# Altium schematic sheet pca10171_io_expander.SchDoc: =BoardTitle + ' - IO Expander'
size A3; Organization: Nordic Semiconductor; DocumentNumber: 5; SheetNumber: 5; SheetTotal: 10; CompanyName: Nordic Semiconductor; DocumentSize: A3
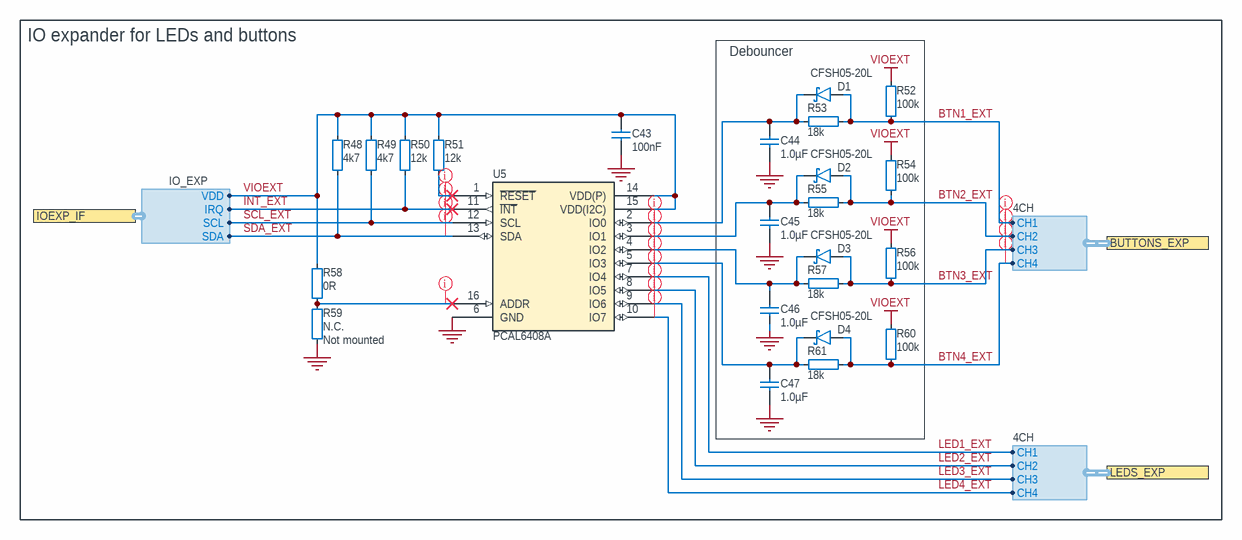
[diagram p0: pca10171_io_expander.SchDoc]

## Parts
C43  100nF  [CAPC0603X03L_C]
C44  1.0µF  [CAPC0603X03L_C]
C45  1.0µF  [CAPC0603X03L_C]
C46  1.0µF  [CAPC0603X03L_C]
C47  1.0µF  [CAPC0603X03L_C]
D1  CFSH05-20L  [SODFL35X40-2N]
D2  CFSH05-20L  [SODFL35X40-2N]
D3  CFSH05-20L  [SODFL35X40-2N]
D4  CFSH05-20L  [SODFL35X40-2N]
R48  4k7  [RESC0603X03L_C]
R49  4k7  [RESC0603X03L_C]
R50  12k  [RESC0603X03L_C]
R51  12k  [RESC0603X03L_C]
R52  100k  [RESC0603X03L_C]
R53  18k  [RESC0603X03L_C]
R54  100k  [RESC0603X03L_C]
R55  18k  [RESC0603X03L_C]
R56  100k  [RESC0603X03L_C]
R57  18k  [RESC0603X03L_C]
R58  0R  [RESC0603X03L_C]
R59  N.C.  Assembly: Not mounted  [RESC0603X03L_C_NC]
R60  100k  [RESC0603X03L_C]
R61  18k  [RESC0603X03L_C]
U5  PCAL6408A  [XQFN40P180X260X50-16N]

## Blocks framed on the sheet
IO expander for LEDs and buttons: C43 R48-R51 R58 R59 U5
Debouncer: C44-C47 D1-D4 R52-R57 R60 R61

## Ports
BUTTONS_EXP (harness 4CH), IOEXP_IF (harness IO_EXP), LEDS_EXP (harness 4CH)

## Harnesses
IO_EXP: VDD, SCL, SDA, IRQ
4CH: CH1, CH2, CH3, CH4

## Nets
GND: C43.1 C44.2 C45.1 C46.1 C47.1 R59.1 U5.6(GND)
VIOEXT: C43.2 R48.2 R49.2 R50.2 R51.2 R52.2 R54.2 R56.2 R58.2 R60.2 U5.14(VDD(P)) U5.15(VDD(I2C)) ; port IOEXP_IF.VDD
BTN1_EXT: D1.1(A) R52.1 R53.2 ; port BUTTONS_EXP.CH1
BTN2_EXT: D2.1(A) R54.1 R55.2 ; port BUTTONS_EXP.CH2
BTN3_EXT: D3.1(A) R56.1 R57.2 ; port BUTTONS_EXP.CH3
BTN4_EXT: D4.1(A) R60.1 R61.2 ; port BUTTONS_EXP.CH4
INT_EXT: R50.1 U5.11(~{INT}) ; port IOEXP_IF.IRQ
LED1_EXT: U5.7(IO4) ; port LEDS_EXP.CH1
LED2_EXT: U5.8(IO5) ; port LEDS_EXP.CH2
LED3_EXT: U5.9(IO6) ; port LEDS_EXP.CH3
LED4_EXT: U5.10(IO7) ; port LEDS_EXP.CH4
SCL_EXT: R49.1 U5.12(SCL) ; port IOEXP_IF.SCL
SDA_EXT: R48.1 U5.13(SDA) ; port IOEXP_IF.SDA
NetC44_1: C44.1 D1.3(C) R53.1 U5.2(IO0)
NetC45_2: C45.2 D2.3(C) R55.1 U5.3(IO1)
NetC46_2: C46.2 D3.3(C) R57.1 U5.4(IO2)
NetC47_2: C47.2 D4.3(C) R61.1 U5.5(IO3)
NetR51_1: R51.1 U5.1(~{RESET})
NetR58_1: R58.1 R59.2 U5.16(ADDR)

## Layout directives
net class GPIO: BTN1_EXT, BTN2_EXT, BTN3_EXT, BTN4_EXT, INT_EXT, LED1_EXT, LED2_EXT, LED3_EXT, LED4_EXT, NetC44_1, NetC45_2, NetC46_2, NetC47_2, NetR51_1, NetR58_1, SCL_EXT, SDA_EXT

## Notes on the sheet
- Title
- Size
- Date:
- File:
- A3
- PCB Assembly Number
- Sheet         of
- Drawn By:
- Revision
- Classification:

## Library data of the parts
C43 = C0201-100n: Capacitor, X5R, ±10%; Manufacturer: N.A.; Part number IPS: 00000001248, 00000002505; Part number Norautron: 262071862; Part number NEMS: 100200078; Note: 16V; Pad Count: 2; Component Status: Active; Part Number: C0201-100n; Manufacturer Part Number: N.A.; Footprint Doc: 0201; LatestRevisionDate: 2017-11-09; Published: 2014-11-13; Value: 100nF; Artikkelnr Noca: N.A.; ComponentLink1URL: N.A.; ComponentLink1Description: Datasheet; ComponentLink2URL: N.A.; ComponentLink2Description: Supplier link; HelpURL: N.A.; Supplier 1: N.A.; Supplier Part Number 1: N.A.; Supplier 2: N.A.; Supplier Part Number 2: N.A.; PartId: 100200078; Component Class: Capacitors; Author: rsk
C44-C47 = C0201-1µ0: Capacitor, X5R, ±10%; Manufacturer: N.A.; Part number IPS: 00000001723; Part number NEMS: 100200084; Note: 10V; Pad Count: 2; Component Status: Active; Part Number: C0201-1µ0; Manufacturer Part Number: N.A.; Footprint Doc: 0201; LatestRevisionDate: 2016-08-22; Published: 2009-05-08; Value: 1.0µF; Artikkelnr Noca: N.A.; ComponentLink1URL: N.A.; ComponentLink1Description: Datasheet; ComponentLink2URL: N.A.; ComponentLink2Description: Supplier link; HelpURL: N.A.; Supplier 1: Digi-Key; Supplier Part Number 1: 1276-6795-1-ND; Supplier 2: N.A.; Supplier Part Number 2: N.A.; PartId: 100200084; Component Class: Capacitors; Author: rsk; Part number Norautron: N.A.
D1-D4 = CFSH05-20L: DIODE SCHOTTKY 20V 500MA SOD882; Manufacturer: Central Semiconductor Corp.; Part number IPS: 00000002493; Part number NEMS: 101300101; Note: N.A.; Pad Count: 2; Component Status: Active; Part Number: CFSH05-20L; Manufacturer Part Number: CFSH05-20L; Footprint Doc: SOD-882L; LatestRevisionDate: 2015-01-30; Published: 2015-01-30; Value: CFSH05-20L; Artikkelnr Noca: N.A.; ComponentLink1URL: N.A.; ComponentLink1Description: Datasheet; ComponentLink2URL: N.A.; ComponentLink2Description: Supplier link; HelpURL: http://www.centralsemi.com/PDFs/products/CFSH05-20L.PDF; Supplier 1: Digi-Key; Supplier Part Number 1: CFSH05-20L CT-ND; Supplier 2: N.A.; Supplier Part Number 2: N.A.; PartId: 101300101; Component Class: Semiconductors; Author: rsk; Part number Norautron: N.A.
R48 R49 = R0201-4k7: Resistor, ±1%, 0.05W; Manufacturer: N.A.; Part number IPS: 00000001706; Part number NEMS: 100100061; Note: Chip Res 1%; Pad Count: 2; Component Status: Active; Part Number: R0201-4k7; Manufacturer Part Number: N.A.; Footprint Doc: 0201; LatestRevisionDate: 2014-11-13; Published: 2014-11-13; Value: 4k7; Artikkelnr Noca: N.A.; ComponentLink1URL: N.A.; ComponentLink1Description: Datasheet; ComponentLink2URL: N.A.; ComponentLink2Description: Supplier link; HelpURL: N.A.; Supplier 1: N.A.; Supplier Part Number 1: N.A.; Supplier 2: N.A.; Supplier Part Number 2: N.A.; PartId: 100100061; Component Class: Resistors; Author: rsk; Part number Norautron: N.A.
R50 R51 = R0201-12k: Resistor, ±1%, 0.05W; Manufacturer: N.A.; Part number IPS: 00000007891; Part number Norautron: 26192279; Part number NEMS: 100100066; Note: Chip Res 1%; Pad Count: 2; Component Status: Active; Part Number: R0201-12k; Manufacturer Part Number: N.A.; Footprint Doc: 0201; LatestRevisionDate: 2014-11-13; Published: 2014-11-13; Value: 12k; Artikkelnr Noca: N.A.; ComponentLink1URL: N.A.; ComponentLink1Description: Datasheet; ComponentLink2URL: N.A.; ComponentLink2Description: Supplier link; HelpURL: N.A.; Supplier 1: N.A.; Supplier Part Number 1: N.A.; Supplier 2: N.A.; Supplier Part Number 2: N.A.; PartId: 100100066; Component Class: Resistors; Author: rsk
R52 R54 R56 R60 = R0201-100k: Resistor, ±1%, 0.05W; Manufacturer: N.A.; Part number IPS: 00000001419; Part number Norautron: 26108487; Part number NEMS: 100100080; Note: Chip Res 1%; Pad Count: 2; Component Status: Active; Part Number: R0201-100k; Manufacturer Part Number: N.A.; Footprint Doc: 0201; LatestRevisionDate: 2014-11-13; Published: 2014-11-13; Value: 100k; Artikkelnr Noca: N.A.; ComponentLink1URL: N.A.; ComponentLink1Description: Datasheet; ComponentLink2URL: N.A.; ComponentLink2Description: Supplier link; HelpURL: N.A.; Supplier 1: N.A.; Supplier Part Number 1: N.A.; Supplier 2: N.A.; Supplier Part Number 2: N.A.; PartId: 100100080; Component Class: Resistors; Author: rsk
R53 R55 R57 R61 = R0201-18k: Resistor, ±1%, 0.05W; Manufacturer: N.A.; Part number IPS: 00000001707; Part number NEMS: 100100069; Note: Chip Res 1%; Pad Count: 2; Component Status: Active; Part Number: R0201-18k; Manufacturer Part Number: N.A.; Footprint Doc: 0201; LatestRevisionDate: 2014-11-13; Published: 2014-11-13; Value: 18k; Artikkelnr Noca: N.A.; ComponentLink1URL: N.A.; ComponentLink1Description: Datasheet; ComponentLink2URL: N.A.; ComponentLink2Description: Supplier link; HelpURL: N.A.; Supplier 1: N.A.; Supplier Part Number 1: N.A.; Supplier 2: N.A.; Supplier Part Number 2: N.A.; PartId: 100100069; Component Class: Resistors; Author: rsk; Part number Norautron: N.A.
R58 = R0201-0R: Resistor, ±5%, 0.05W; Manufacturer: N.A.; Part number IPS: 00000003245; Part number NEMS: 100100001; Note: Chip Res 5%; Pad Count: 2; Component Status: Active; Part Number: R0201-0R; Manufacturer Part Number: N.A.; Footprint Doc: 0201; LatestRevisionDate: 2017-11-09; Published: 2014-11-13; Value: 0R; Artikkelnr Noca: N.A.; ComponentLink1URL: N.A.; ComponentLink1Description: Datasheet; ComponentLink2URL: N.A.; ComponentLink2Description: Supplier link; HelpURL: N.A.; Supplier 1: N.A.; Supplier Part Number 1: N.A.; Supplier 2: N.A.; Supplier Part Number 2: N.A.; PartId: 100100001; Component Class: Resistors; Author: rsk; Part number Norautron: N.A.
R59 = R0201-N.C.: Not mounted; Manufacturer: N.A.; Part number NEMS: 100100107; Note: Chip Res; Pad Count: 2; Component Status: Active; Part Number: R0201-N.C.; Manufacturer Part Number: N.A.; Footprint Doc: 0201; LatestRevisionDate: 2014-11-13; Published: 2014-11-13; Value: N.C.; Artikkelnr Noca: N.A.; Part number IPS: N.A.; ComponentLink1URL: N.A.; ComponentLink1Description: Datasheet; ComponentLink2URL: N.A.; ComponentLink2Description: Supplier link; HelpURL: N.A.; Supplier 1: N.A.; Supplier Part Number 1: N.A.; Supplier 2: N.A.; Supplier Part Number 2: N.A.; PartId: 100100107; Component Class: Resistors; Author: rsk; Part number Norautron: N.A.
U5 = PCAL6408AHK: 8-bit I2C-bus I/O expander with interrupt output; Manufacturer: NXP Semiconductors; Part number IPS: 00000009987; Part number NEMS: 101900289; Note: N.A.; Artikkelnr Noca: 15079321; Pad Count: 16; Component Status: Active; Part Number: PCAL6408AHK; Manufacturer Part Number: PCAL6408AHK; Footprint Doc: XQFN-16; LatestRevisionDate: 2015-04-29; Published: 2015-04-29; Value: PCAL6408A; ComponentLink1URL: N.A.; ComponentLink1Description: Datasheet; ComponentLink2URL: N.A.; ComponentLink2Description: Supplier link; HelpURL: http://www.nxp.com/documents/data_sheet/PCAL6408A.pdf; Supplier 1: Digi-Key; Supplier Part Number 1: 568-9944-1-ND; Supplier 2: Mouser; Supplier Part Number 2: 771-PCAL6408AHKX; PartId: 101900289; Component Class: Misc_ICs; Author: rsk; Part number Norautron: N.A.